# EAGLE schematic uhu-adapter (EAGLE 7.7.0)
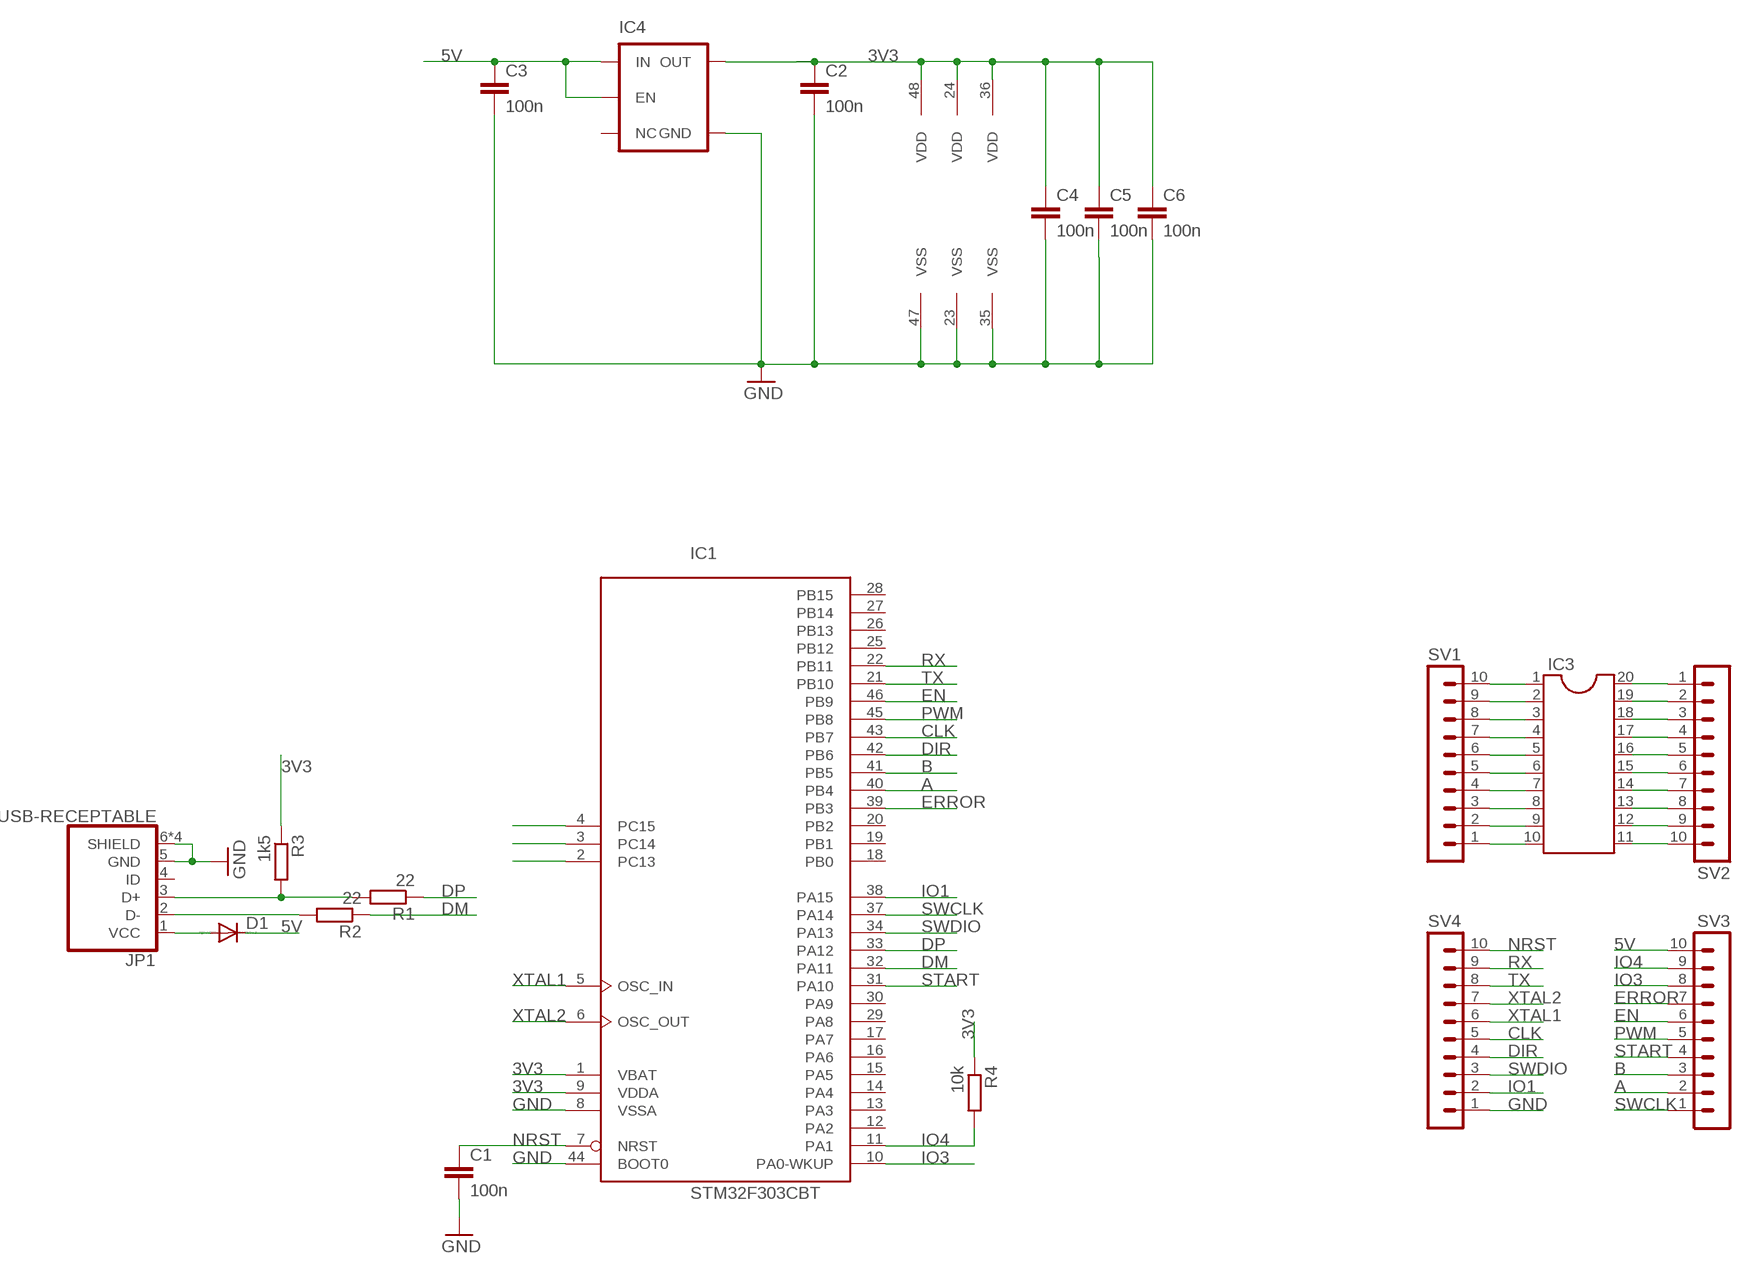
[diagram p0: schematic, sheet 1]

## Parts
C1  100n  C-EUC0603  [C0603]
C2  100n  C-EUC0603  [C0603]
C3  100n  C-EUC0603  [C0603]
C4  100n  C-EUC0603  [C0603]
C5  100n  C-EUC0603  [C0603]
C6  100n  C-EUC0603  [C0603]
D1  DIODE-SOD123  [SOD123]
IC1  STM32F303CBT  [LQFP48]
IC3  DIL20  [DIL20]
IC4  V_REG_TPS76433SOT23-5  [SOT23-5]
JP1  USB-RECEPTABLE  [FCI-10103594-0001LF]
R1  22  R-EU_R0603  [R0603]
R2  22  R-EU_R0603  [R0603]
R3  1k5  R-EU_R0603  [R0603]
R4  10k  R-EU_R0603  [R0603]
SV1  MA10-1  [MA10-1]
SV2  MA10-1  [MA10-1]
SV3  MA10-1  [MA10-1]
SV4  MA10-1  [MA10-1]

## Nets
3V3: C2.1 C4.1 C5.1 C6.1 IC1.1(VBAT) IC1.9(VDDA) IC1.24(VDD) IC1.36(VDD) IC1.48(VDD) IC4.5(OUT) R3.1 R4.1
5V: C3.1 D1.C IC4.1(IN) IC4.3(EN) SV3.10
5VUSB: D1.A JP1.1(VCC)
A: IC1.40(PB4) SV3.2
B: IC1.41(PB5) SV3.3
CLK: IC1.43(PB7) SV4.5
DIR: IC1.42(PB6) SV4.4
DM: IC1.32(PA11) R2.1
DP: IC1.33(PA12) R1.1
EN: IC1.46(PB9) SV3.6
ERROR: IC1.39(PB3) SV3.7
GND: C1.2 C2.2 C3.2 C4.2 C5.2 C6.2 IC1.8(VSSA) IC1.23(VSS) IC1.35(VSS) IC1.44(BOOT0) IC1.47(VSS) IC4.2(GND) JP1.5(GND) JP1.6(SHIELD) JP1.7(SHIELD) JP1.8(SHIELD) JP1.9(SHIELD) SV4.1
IO1: IC1.38(PA15) SV4.2
IO3: IC1.10(PA0-WKUP) SV3.8
IO4: IC1.11(PA1) R4.2 SV3.9
N$1: IC3.10 SV1.1
N$2: IC3.9 SV1.2
N$3: IC3.8 SV1.3
N$4: IC3.7 SV1.4
N$5: IC3.6 SV1.5
N$6: IC3.5 SV1.6
N$7: IC3.4 SV1.7
N$8: IC3.3 SV1.8
N$9: IC3.2 SV1.9
N$10: IC3.1 SV1.10
N$11: IC3.20 SV2.1
N$12: IC3.19 SV2.2
N$13: IC3.18 SV2.3
N$14: IC3.17 SV2.4
N$15: IC3.16 SV2.5
N$16: IC3.15 SV2.6
N$17: IC3.14 SV2.7
N$18: IC3.13 SV2.8
N$19: IC3.12 SV2.9
N$20: IC3.11 SV2.10
N$21: IC1.2(PC13)
N$22: IC1.3(PC14)
N$23: JP1.3(D+) R1.2 R3.2
N$24: JP1.2(D-) R2.2
N$25: IC1.4(PC15)
NRST: C1.1 IC1.7(NRST) SV4.10
PWM: IC1.45(PB8) SV3.5
RX: IC1.22(PB11) SV4.9
START: IC1.31(PA10) SV3.4
SWCLK: IC1.37(PA14) SV3.1
SWDIO: IC1.34(PA13) SV4.3
TX: IC1.21(PB10) SV4.8
XTAL1: IC1.5(OSC_IN) SV4.6
XTAL2: IC1.6(OSC_OUT) SV4.7
Unconnected: IC1.12(PA2) IC1.13(PA3) IC1.14(PA4) IC1.15(PA5) IC1.16(PA6) IC1.17(PA7) IC1.18(PB0) IC1.19(PB1) IC1.20(PB2) IC1.25(PB12) IC1.26(PB13) IC1.27(PB14) IC1.28(PB15) IC1.29(PA8) IC1.30(PA9) IC4.4(NC) JP1.4(ID)

## Library data of the parts
C1-C6 = rcl:C-EU: CAPACITOR, European symbol
D1 = diode:DIODE-: DIODE
IC1 = micro-stm_v2:STM32F303C*T: ARM 32-bit Cortex™-M3 CPU 72 MHz maximum frequency 128 to 256 Kbytes of Flash memory 32 to 40 kbytes of SRAM 37 GPIOs 2.0 to 3.6 V application supply
IC3 = ic-package:DIL20: Dual In Line / Socket
IC4 = SparkFun-PowerIC:V_REG_TPS76433: Voltage Regulator Older TI part. LDO 150mA regulator. No output by-pass cap option. See V_REG_LDO for a better part.
JP1 = reroolib:USB-RECEPTABLE: USB Receptable
R1-R4 = rcl:R-EU_: RESISTOR, European symbol
SV1-SV4 = con-lstb:MA10-1: PIN HEADER; OC_FARNELL: unknown; OC_NEWARK: unknown